# EAGLE design entrenador (EAGLE 7.3.0)
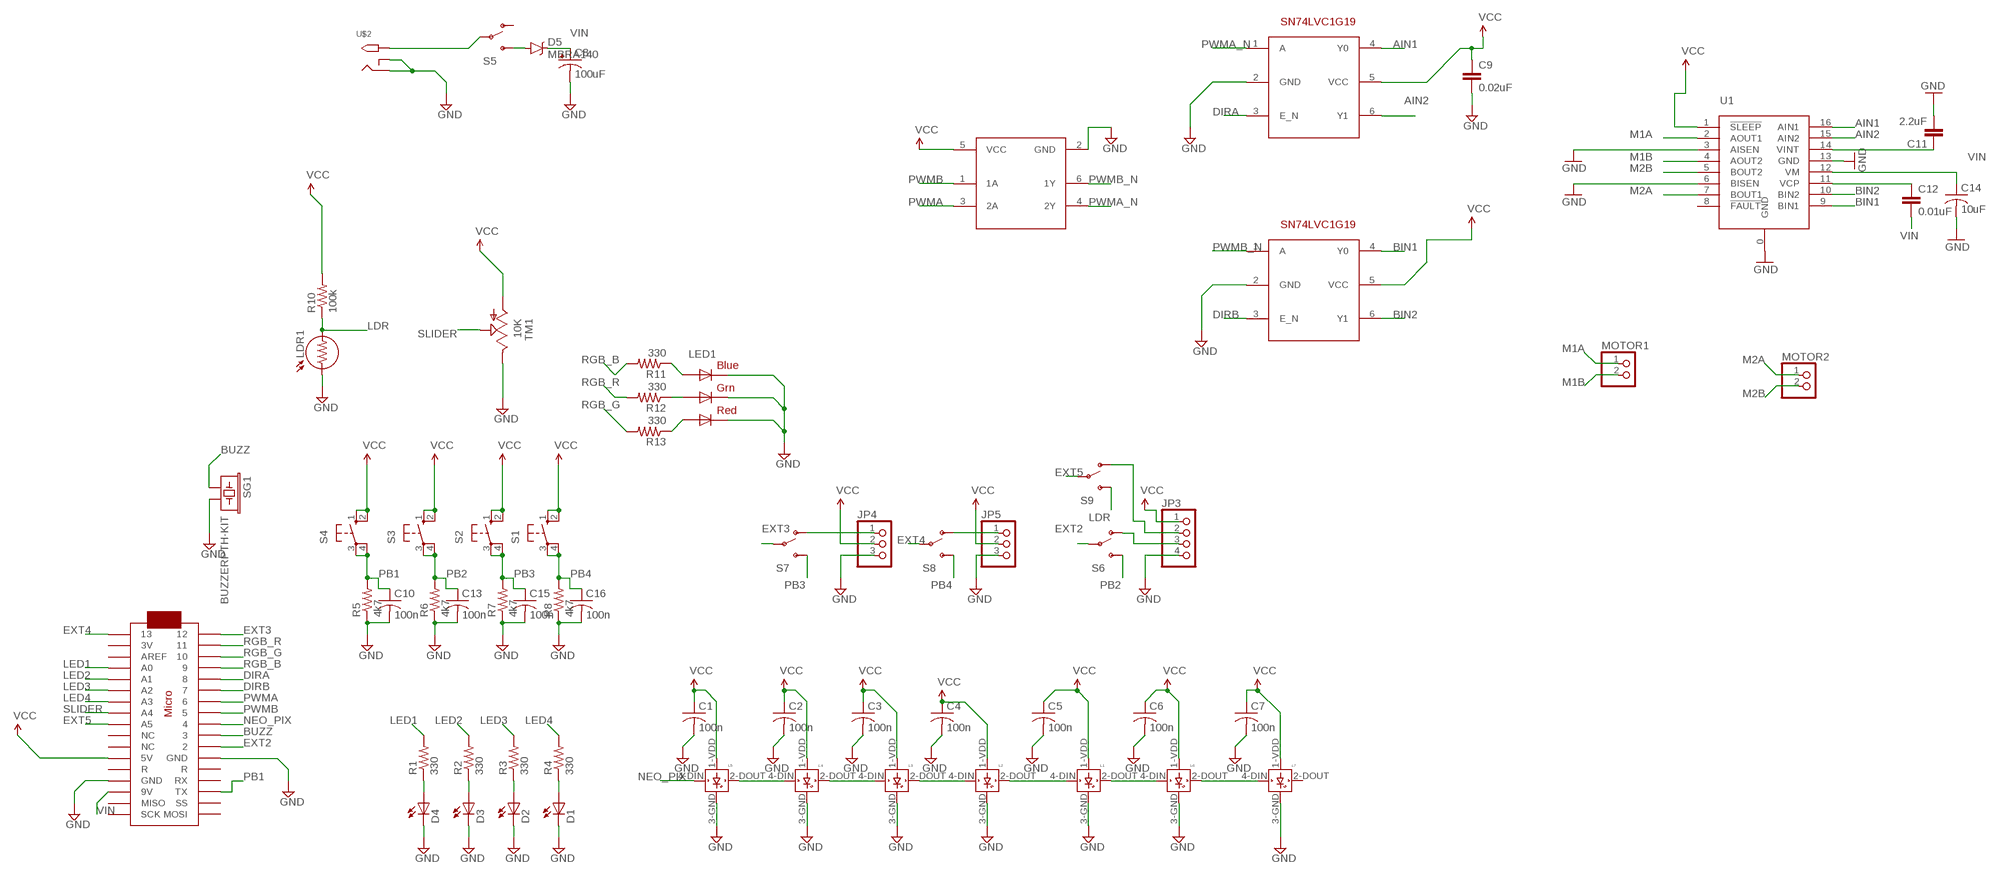
[diagram p0: schematic, sheet 1]

## Parts
C1  100n  C-USC0805  [C0805]
C2  100n  C-USC0805  [C0805]
C3  100n  C-USC0805  [C0805]
C4  100n  C-USC0805  [C0805]
C5  100n  C-USC0805  [C0805]
C6  100n  C-USC0805  [C0805]
C7  100n  C-USC0805  [C0805]
C8  100uF  CPOL-US175TMP-0808  [175TMP-0808]
C9  0.02uF  C-EUC0805  [C0805]
C10  100n  C-USC0805  [C0805]
C11  2.2uF  C-EUC0805  [C0805]
C12  0.01uF  C-EUC0805  [C0805]
C13  100n  C-USC0805  [C0805]
C14  10uF  C-USC0805K  [C0805K]
C15  100n  C-USC0805  [C0805]
C16  100n  C-USC0805  [C0805]
D1  LED5MM  [LED5MM]
D2  LED5MM  [LED5MM]
D3  LED5MM  [LED5MM]
D4  LED5MM  [LED5MM]
D5  MBRA140  [SMA-DIODE]
JP3  PINHD-1X4/90  [1X04/90]
JP4  PINHD-1X3/90  [1X03/90]
JP5  PINHD-1X3/90  [1X03/90]
L1  WS2812B  [WS2812B]
L2  WS2812B  [WS2812B]
L3  WS2812B  [WS2812B]
L4  WS2812B  [WS2812B]
L5  WS2812B  [WS2812B]
L6  WS2812B  [WS2812B]
L7  WS2812B  [WS2812B]
LDR1  LDR5MM  [LDR338-54C]
LED1  RGBLED5050  [RGBLED5050]
MOTOR1  PINHD-1X2/90  [1X02/90]
MOTOR2  PINHD-1X2/90  [1X02/90]
R1  330  R-US_M0805  [M0805]
R2  330  R-US_M0805  [M0805]
R3  330  R-US_M0805  [M0805]
R4  330  R-US_M0805  [M0805]
R5  4k7  R-US_M0805  [M0805]
R6  4k7  R-US_M0805  [M0805]
R7  4k7  R-US_M0805  [M0805]
R8  4k7  R-US_M0805  [M0805]
R10  100k  R-US_M0805  [M0805]
R11  330  R-US_M0805  [M0805]
R12  330  R-US_M0805  [M0805]
R13  330  R-US_M0805  [M0805]
S1  40-XX-ROUND  [B3F-40XX-ROUND]
S2  40-XX-ROUND  [B3F-40XX-ROUND]
S3  40-XX-ROUND  [B3F-40XX-ROUND]
S4  40-XX-ROUND  [B3F-40XX-ROUND]
S5  SWITCH-SPDT-SMD-A  [SWITCH-SPST-SMD-A]
S6  SWITCH-SPDTSS-12F44  [SS-12F44G4]
S7  SWITCH-SPDTSS-12F44  [SS-12F44G4]
S8  SWITCH-SPDTSS-12F44  [SS-12F44G4]
S9  SWITCH-SPDTSS-12F44  [SS-12F44G4]
SG1  BUZZERPTH-KIT  [BUZZER-12MM-KIT]
TM1  10K  TRIMSLIDEPOT-60  [SLIDEPOT-60]
U1  DRV8833  [PWP16]
U$1  SN74LVC1G19SN74LVC1G19-DBVR  [SOT23-6]
U$2  2.1MMJACKTHM  [PJ-102A]
U$8  ARDUINOMICRO  [ARDUINOMICRO]
U$9  SN74LVC1G19SN74LVC1G19-DBVR  [SOT23-6]
U$10  SN74LVC2G04SOT23-6  [SOT23-6]

## Nets
AIN1: U1.16(AIN1) U$1.4(Y0)
AIN2: U1.15(AIN2) U$1.6(Y1)
BIN1: U1.9(BIN1) U$9.4(Y0)
BIN2: U1.10(BIN2) U$9.6(Y1)
BUZZ: SG1.+ U$8.P$10
DIRA: U$1.3(E_N) U$8.P$5
DIRB: U$8.P$6 U$9.3(E_N)
EXT2: S6.2(P) U$8.P$11
EXT3: S7.2(P) U$8.P$1
EXT4: S8.2(P) U$8.P$34
EXT5: S9.2(P) U$8.P$26(A5)
GND: C1.2 C2.2 C3.2 C4.2 C5.2 C6.2 C7.2 C8.- C9.2 C10.2 C11.2 C13.2 C14.2 C15.2 C16.2 D1.K(C) D2.K(C) D3.K(C) D4.K(C) JP3.4 JP4.3 JP5.3 L1.3-GND(GND) L2.3-GND(GND) L3.3-GND(GND) L4.3-GND(GND) L5.3-GND(GND) L6.3-GND(GND) L7.3-GND(GND) LDR1.1 LED1.4(BLUE_C) LED1.5(RED_C) LED1.6(GREEN_C) R5.1 R6.1 R7.1 R8.1 SG1.- TM1.C(E) U1.0(GND) U1.3(AISEN) U1.6(BISEN) U1.13(GND) U$1.2(GND) U$2.RING U$2.RING_SW U$8.P$12(GND) U$8.P$21(GND) U$9.2(GND) U$10.2(GND)
LDR: LDR1.2 R10.1 S9.3(S)
LED1: R1.2 U$8.P$31(A0)
LED2: R2.2 U$8.P$30(A1)
LED3: R3.2 U$8.P$29(A2)
LED4: R4.2 U$8.P$28(A3)
M1A: MOTOR1.1 U1.2(AOUT1)
M1B: MOTOR1.2 U1.4(AOUT2)
M2A: MOTOR2.1 U1.7(BOUT1)
M2B: MOTOR2.2 U1.5(BOUT2)
N$1: D5.A S5.3(S)
N$3: JP3.3 S6.1(O)
N$4: JP3.2 S9.1(O)
N$5: D1.A R4.1
N$6: D2.A R3.1
N$7: D3.A R2.1
N$8: D4.A R1.1
N$9: JP4.1 S7.1(O)
N$10: LED1.3(BLUE_A) R11.1
N$11: LED1.1(GREEN_A) R12.1
N$12: LED1.2(RED_A) R13.1
N$14: C12.1 U1.11(VCP)
N$15: L4.4-DIN(DIN) L5.2-DOUT(DOUT)
N$16: L3.4-DIN(DIN) L4.2-DOUT(DOUT)
N$17: L2.4-DIN(DIN) L3.2-DOUT(DOUT)
N$18: L1.4-DIN(DIN) L2.2-DOUT(DOUT)
N$19: L1.2-DOUT(DOUT) L6.4-DIN(DIN)
N$20: L6.2-DOUT(DOUT) L7.4-DIN(DIN)
N$21: JP5.1 S8.1(O)
N$24: S5.2(P) U$2.TIP
N$63: C11.1 U1.14(VINT)
NEO_PIX: L5.4-DIN(DIN) U$8.P$9
PB1: C10.1 R5.2 S4.3(P) S4.4(P1) U$8.P$15(TX)
PB2: C13.1 R6.2 S3.3(P) S3.4(P1) S6.3(S)
PB3: C15.1 R7.2 S2.3(P) S2.4(P1) S7.3(S)
PB4: C16.1 R8.2 S1.3(P) S1.4(P1) S8.3(S)
PWMA: U$8.P$7 U$10.3(2A)
PWMA_N: U$1.1(A) U$10.4(2Y)
PWMB: U$8.P$8 U$10.1(1A)
PWMB_N: U$9.1(A) U$10.6(1Y)
RGB_B: R11.2 U$8.P$4
RGB_G: R13.2 U$8.P$3
RGB_R: R12.2 U$8.P$2
SLIDER: TM1.B(S) U$8.P$27(A4)
VCC: C1.1 C2.1 C3.1 C4.1 C5.1 C6.1 C7.1 C9.1 JP3.1 JP4.2 JP5.2 L1.1-VDD(VDD) L2.1-VDD(VDD) L3.1-VDD(VDD) L4.1-VDD(VDD) L5.1-VDD(VDD) L6.1-VDD(VDD) L7.1-VDD(VDD) R10.2 S1.1(S) S1.2(S1) S2.1(S) S2.2(S1) S3.1(S) S3.2(S1) S4.1(S) S4.2(S1) TM1.A U1.1(!SLEEP) U$1.5(VCC) U$8.P$23(5V) U$9.5(VCC) U$10.5(VCC)
VIN: C8.+ C12.2 C14.1 D5.C U1.12(VM) U$8.P$20(9V)
Unconnected: L7.2-DOUT(DOUT) S5.1(O) U1.8(!FAULT) U$8.P$13(R) U$8.P$14(RX) U$8.P$16(SS) U$8.P$17(MOSI) U$8.P$18(SCK) U$8.P$19(MISO) U$8.P$22(R) U$8.P$24(NC) U$8.P$25(NC) U$8.P$32(AREF) U$8.P$33(3V)

## Library data of the parts
C1-C7 C10 C13-C16 = adafruit:C-US: CAPACITOR, American symbol
C8 = adafruit:CPOL-US: POLARIZED CAPACITOR, American symbol
C9 C11 C12 = rcl:C-EU: CAPACITOR, European symbol
D1-D4 = adafruit:LED: LED OSRAM: - CHIPLED LG R971, LG N971, LY N971, LG Q971, LY Q971, LO R971, LY R971 LH N974, LH R974 LS Q976, LO Q976, LY Q976 LO Q996 - Hyper CHIPLED LW Q18S LB Q993, LB Q99A, LB R99A - SideLED LS A670, LO A670, LY A670, LG A670, LP A670 LB A673, LV A673, LT A673, LW A673 LH A674 LY A675 LS A676, LA A676, LO A676, LY A676, LW A676 LS A679, LY A679, LG A679 - Hyper Micro SIDELED® LS Y876, LA Y876, LO Y876, LY Y876 LT Y87S - SmartLED LW L88C, LW L88S LB L89C, LB L89S, LG L890 LS L89K, LO L89K, LY L89K LS L896, LA L896, LO L896, LY L896 - TOPLED LS T670, LO T670, LY T670, LG T670, LP T670 LSG T670, LSP T670, LSY T670, LOP T670, LYG T670 LG T671, LOG T671, LSG T671 LB T673, LV T673, LT T673, LW T673 LH T674 LS T676, LA T676, LO T676, LY T676, LB T676, LH T676, LSB T676, LW T676 LB T67C, LV T67C, LT T67C, LS T67K, LO T67K, LY T67K, LW E67C LS E67B, LA E67B, LO E67B, LY E67B, LB E67C, LV E67C, LT E67C LW T67C LS T679, LY T679, LG T679 LS T770, LO T770, LY T770, LG T770, LP T770 LB T773, LV T773, LT T773, LW T773 LH T774 LS E675, LA E675, LY E675, LS T675 LS T776, LA T776, LO T776, LY T776, LB T776 LHGB T686 LT T68C, LB T68C - Hyper Mini TOPLED® LB M676 - Mini TOPLED Santana® LG M470 LS M47K, LO M47K, LY M47K Source: http://www.osram.convergy.de/
D5 = SparkFun-DiscreteSemi:MBRA140: 40V, 1A Schottky rectifier SMA/DO-214AC package DIO-08053; PROD_ID: DIO-08053
JP3 = pinhead:PINHD-1X4: PIN HEADER
JP4 JP5 = pinhead:PINHD-1X3: PIN HEADER
L1-L7 = adafruit:WS2812B
LDR1 = gm-resistors:LDR
LED1 = adafruit:RGBLED: For 5050 RGB LEDs, the order of the LEDs may vary from one manufacturer to another!
MOTOR1 MOTOR2 = pinhead:PINHD-1X2: PIN HEADER
R1-R8 R10-R13 = rcl:R-US_: RESISTOR, American symbol
S1-S4 = adafruit:40-XX: OMRON SWITCH
S5 = SparkFun-Electromechanical:SWITCH-SPDT: SPDT Switch Simple slide switch, Spark Fun Electronics SKU : COM-00102 DPDT SMT slide switch, AYZ0202, SWCH-08179; PROD_ID: SWCH-10651
S6-S9 = SparkFun-Electromechanical:SWITCH-SPDT: SPDT Switch Simple slide switch, Spark Fun Electronics SKU : COM-00102 DPDT SMT slide switch, AYZ0202, SWCH-08179
SG1 = SparkFun-Electromechanical:BUZZER: Buzzer 12mm Spark Fun Electronics SKU : Comp-Buzzer; PROD_ID: COMP-08253
TM1 = adafruit:TRIM
U1 = DRV8833:DRV8833
U$1 U$9 = frizzy:SN74LVC1G19
U$2 = adafruit:2.1MMJACK: 2.1mm x 5.5mm THM DC jack with internal switch. Digikey part #PJ-102A, 4UCON part #05537 2.1mm x 5.5mm SMT DC jack with internal switch. Digikey part #PJ-002A-SMT, 4UCON part #03267 By microbuilder.eu & adafruit.com
U$8 = adafruit:ARDUINOMICRO
U$10 = frizzy:SN74LVC2G04

## Board
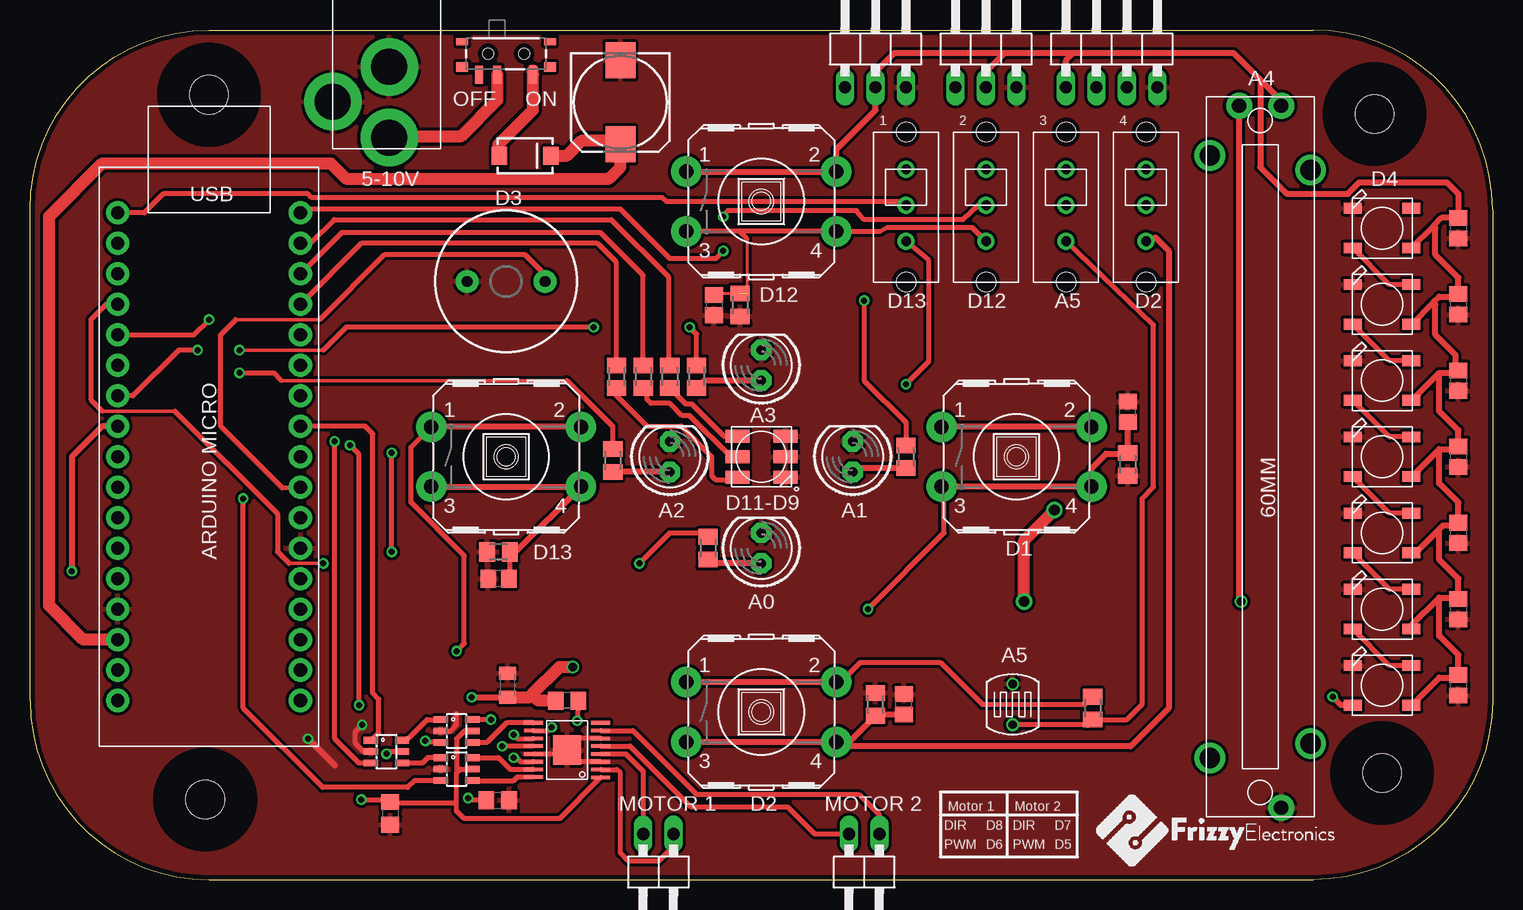
[diagram p1: board, top side]
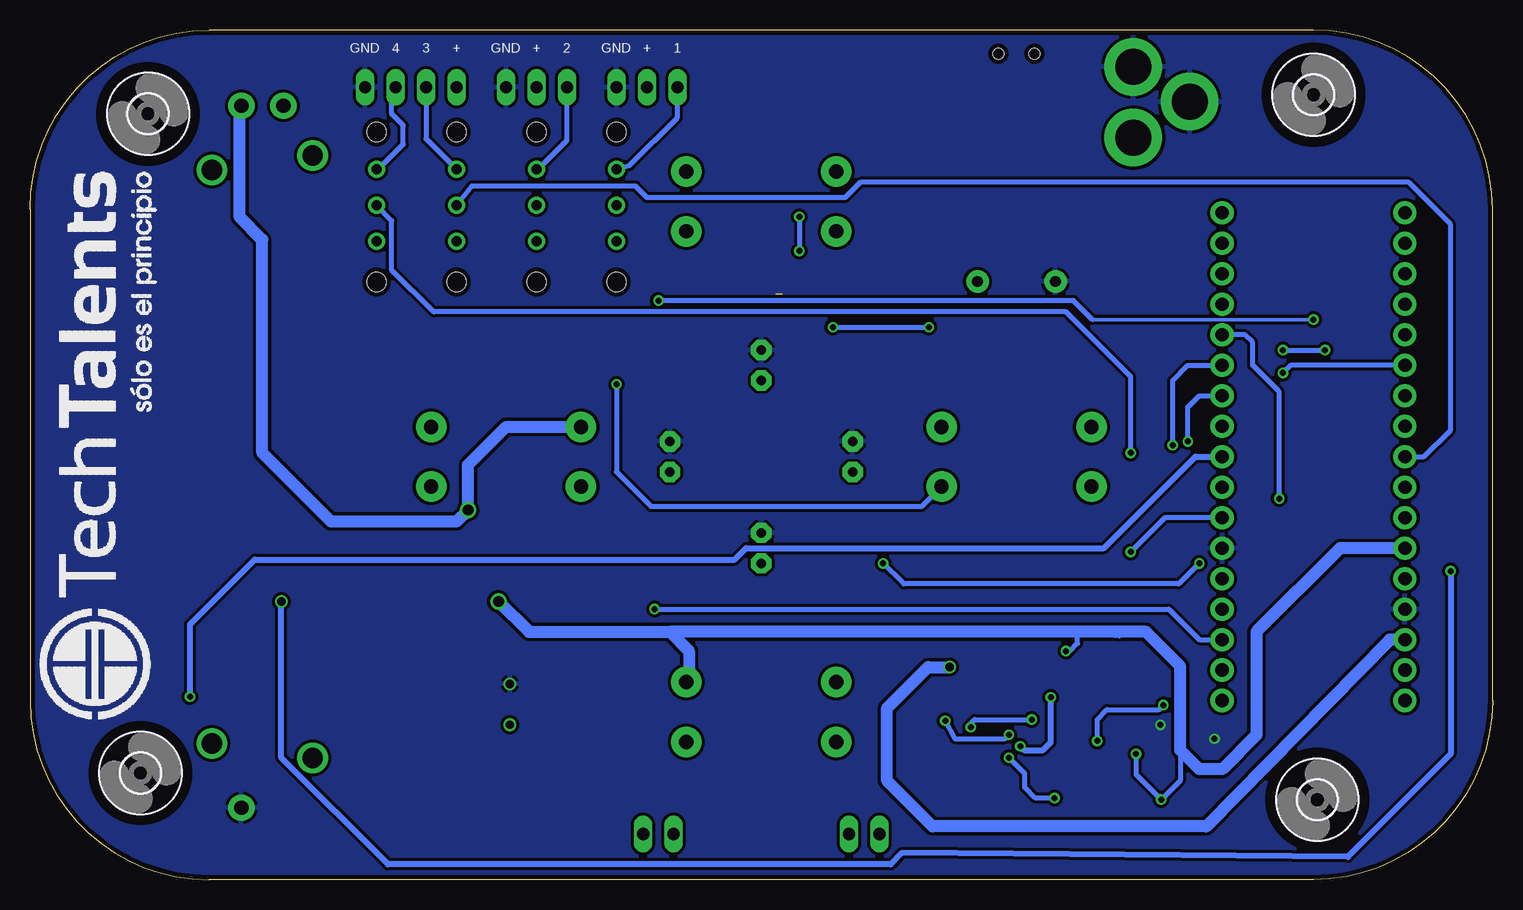
[diagram p2: board, bottom side, seen from below]

Size 121.92 x 70.8 mm. Coordinates in mm from the lower left corner, seen from the top.
Outline: 0,14.92 0,55.88 arc-90 14.92,70.8 107,70.8 arc-90 121.92,55.88 121.92,14.92 arc-90 107,0 14.92,0 arc-90 0,14.92
Copper layers (1*16): Top 0.0356mm / dielectric 1.5011mm / Bottom 0.0356mm
Design rules "oshpark-2layer": minimum track width 6mil, minimum drill 13mil, track to track 6mil, track to pad 6mil, pad to pad 6mil, via to via 6mil, smd to smd 6mil, copper to edge 15mil, drill to drill 6mil, minimum pad ring 7mil, minimum via ring 7mil, stop-mask expansion 2.5mil, vias tented up to drill 0mil, thermal gap 10mil

### Footprints (pad centres in the part's own frame; a part is rotated, then mirrored left to right if it is on the bottom)
C0805 = smd 1.3 x 1.5: 1 -0.85,0; 2 0.85,0
175TMP-0808 = smd 3 x 2.5: + 3.5,0; - -3.5,0
C0805' = smd 1.3 x 1.5: 1 -0.95,0; 2 0.95,0
C0805K = smd 1.1 x 1.4: 1 -1,0; 2 1,0
LED5MM = drill 0.813 pad 1.676 octagon: A -1.27,0; K 1.27,0
SMA-DIODE = smd 1.27 x 1.47: A -2.15,0; C 2.15,0
1X04/90 = drill 1.016 long: 1 -3.81,-3.81; 2 -1.27,-3.81; 3 1.27,-3.81; 4 3.81,-3.81
1X03/90 = drill 1.016 long: 1 -2.54,-3.81; 2 0,-3.81; 3 2.54,-3.81
WS2812B = smd 1.5 x 0.9: 1-VDD 2.45,-1.65; 2-DOUT 2.45,1.65; 3-GND -2.45,1.65; 4-DIN -2.45,-1.65
LDR338-54C = drill 0.7: 1 0,1.702; 2 0,-1.702
RGBLED5050 = smd 2 x 1.1: 1 -2,1.7; 2 -2,0; 3 -2,-1.7; 4 2,-1.7; 5 2,0; 6 2,1.7
1X02/90 = drill 1.016 long: 1 -1.27,-3.81; 2 1.27,-3.81
M0805 = smd 1.3 x 1.6: 1 -0.95,0; 2 0.95,0
B3F-40XX-ROUND = drill 1.194 pad 2.54: 1 -6.248,2.489; 2 6.248,2.489; 3 -6.248,-2.489; 4 6.248,-2.489
SWITCH-SPST-SMD-A = smd 0.7 x 1.5: 1 -2.25,-1.75; 2 -0.75,-1.75; 3 2.25,-1.75 | smd 1 x 0.6: GND1 -3.65,1; GND3 3.65,1 | smd 1 x 0.8: GND2 -3.65,-1.1; GND4 3.65,-1.1 | hole 0.9: -1.5,0; 1.5,0
SS-12F44G4 = drill 0.8 pad 1.422: 1 -3,0; 2 0,0; 3 3,0 | hole 1.6: -6.1,0; 6.4,0
BUZZER-12MM-KIT = drill 0.9 pad 1.88: + 3.25,0; - -3.25,0
SLIDEPOT-60 = drill 1.2 pad 2.184: A -29.249,1.751; B -29.249,-1.749; C 29.251,1.751 | drill 1.7 pad 2.54: P$1 -23.899,4.201; P$2 23.901,4.201; P$3 -25.099,-4.199; P$4 25.101,-4.199
PWP16 = smd 2.46 x 2.31: 0 0,0 | smd 0.3 x 1.6: 1 -2.275,-2.8; 2 -1.625,-2.8; 3 -0.975,-2.8; 4 -0.325,-2.8; 5 0.325,-2.8; 6 0.975,-2.8; 7 1.625,-2.8; 8 2.275,-2.8; 9 2.275,2.8; 10 1.625,2.8; 11 0.975,2.8; 12 0.325,2.8; 13 -0.325,2.8; 14 -0.975,2.8; 15 -1.625,2.8; 16 -2.245,2.8
SOT23-6 = smd 0.55 x 1.2: 1 -0.95,-1.3; 2 0,-1.3; 3 0.95,-1.3; 4 0.95,1.3; 5 0,1.3; 6 -0.95,1.3
PJ-102A = drill 3 pad 4.8: RING 0.1,-3.39; RING_SW -4.6,-6.29; TIP 0.1,-9.29
3,2 = hole 3.2: 0,0
ARDUINOMICRO = drill 1.1 pad 1.93: P$1 -20.32,7.62; P$2 -17.78,7.62; P$3 -15.24,7.62; P$4 -12.7,7.62; P$5 -10.16,7.62; P$6 -7.62,7.62; P$7 -5.08,7.62; P$8 -2.54,7.62; P$9 0,7.62; P$10 2.54,7.62; P$11 5.08,7.62; P$12 12.7,-7.62; P$13 10.16,-7.62; P$14 12.7,7.62; P$15 15.24,7.62; P$16 17.78,7.62; P$17 20.32,7.62; P$18 20.32,-7.62; P$19 17.78,-7.62; P$20 15.24,-7.62; P$21 7.62,7.62; P$22 10.16,7.62; P$23 7.62,-7.62; P$24 5.08,-7.62; P$25 2.54,-7.62; P$26 0,-7.62; P$27 -2.54,-7.62; P$28 -5.08,-7.62; P$29 -7.62,-7.62; P$30 -10.16,-7.62; P$31 -12.7,-7.62; P$32 -15.24,-7.62; P$33 -17.78,-7.62; P$34 -20.32,-7.62

### Placement (x,y rotation side)
C1  119.06,54.29 270 top
C2  119.06,47.94 270 top
C3  119.06,41.59 270 top
C4  119.06,35.24 270 top
C5  119.06,28.89 270 top
C6  119.06,22.54 270 top
C7  119.06,16.19 270 top
C8  49.21,64.77 270 top
C9  0.02uF  [C0805']  30.04,5.52 270 top
C10  91.5,38.99 90 top
C11  2.2uF  [C0805']  38.99,6.6 0 top
C12  0.01uF  [C0805']  44.77,14.92 180 top
C13  72.83,14.6 90 top
C14  39.81,16.19 90 top
C15  57.02,47.88 270 top
C16  39.05,25.08 180 top
D1  60.96,42.86 90 top
D2  53.34,35.24 90 top
D3  68.58,35.24 90 top
D4  60.96,27.62 90 top
D5  41.27,60.32 0 top
JP3  90.17,69.85 0 top
JP4  79.69,69.85 0 top
JP5  70.48,69.85 0 top
L1  112.71,41.59 0 top
L2  112.71,35.24 0 top
L3  112.71,28.89 0 top
L4  112.71,22.54 0 top
L5  112.71,16.19 0 top
L6  112.71,47.94 0 top
L7  112.71,54.29 0 top
LDR1  81.92,14.6 0 top
LED1  60.96,35.24 0 top
MOTOR1  52.39,0 180 top
MOTOR2  69.53,0 180 top
R1  56.52,27.62 90 top
R2  73.03,35.24 90 top
R3  48.58,34.92 90 top
R4  55.56,41.91 90 top
R5  91.5,34.61 90 top
R6  70.48,14.6 270 top
R7  59.18,47.88 90 top
R8  39.05,27.3 0 top
R10  88.58,14.29 90 top
R11  48.9,41.91 90 top
R12  53.34,41.91 90 top
R13  51.12,41.91 90 top
S1  39.69,35.24 0 top
S2  60.96,56.52 0 top
S3  60.96,13.97 0 top
S4  82.23,35.24 0 top
S5  39.69,68.83 0 top
S6  93.03,56.2 270 top
S7  79.69,56.2 270 top
S8  73.03,56.2 270 top
S9  86.36,56.2 270 top
SG1  39.69,49.85 0 top
TM1  102.55,35.24 270 top
U1  44.77,10.79 90 top
U$1  35.56,9.21 270 top
U$2  29.84,71.12 0 top
U$3  [3,2]  112.08,63.82 0 bottom
U$4  [3,2]  14.92,65.41 0 bottom
U$5  [3,2]  112.71,8.89 0 bottom
U$6  [3,2]  14.61,6.67 0 bottom
U$8  14.92,35.24 270 top
U$9  35.56,12.38 270 top
U$10  29.72,10.67 270 top

### Tracks (layer width: path | path; a pad name or v marks a point on that pad's centre or on a via)
AIN1
  Top 0.406: U$1.4 40.33,8.26 40.64,8.57 41.95,8.57 U1.16
AIN2
  Top 0.406: U$1.6 39.05,10.16 40.01,9.21 41.93,9.21 U1.15
BIN1
  Top 0.406: U$9.4 38.1,11.43 39.74,13.07 U1.9
BIN2  (via drill 0.5)
  Top 0.406: U1.10 43.22,12.42 v43.5,12.7 | v38.42,13.33 U$9.6
  Bottom 0.406: v43.5,12.7 43.5,13.02 43.18,13.33 v38.42,13.33
BUZZ
  Top 0.305: 24.13,46.67 17.14,46.67
  Top 0.406: SG1.+ 42.94,50.41 41.27,52.07 29.53,52.07 24.13,46.67 | 17.14,46.67 15.88,45.4 15.88,37.78 21.02,32.64 U$8.P$10
DIRA  (via drill 0.5)
  Top 0.406: v17.78,31.75 17.78,14.29 24.38,7.68 31.5,7.68 32.07,8.26 U$1.3
  Bottom 0.406: v17.78,31.75 17.78,40.64 20,42.86 20,44.77 20.64,45.4 U$8.P$5
DIRB  (via drill 0.5)
  Top 0.406: U$9.3 33.08,11.43 v32.96,11.56 | v27.43,14.54 27.43,35.43 v26.67,36.2
  Bottom 0.406: v26.67,36.2 26.67,41.59 25.4,42.86 U$8.P$6 | v32.96,11.56 32.96,13.33 32.13,14.16 27.81,14.16 v27.43,14.54
EXT2  (via drill 0.5)
  Top 0.406: v30.16,27.3 v30.16,35.56
  Bottom 0.406: U$8.P$11 27.3,30.16 v30.16,27.3 | v30.16,35.56 30.16,41.91 35.56,47.31 88.27,47.31 91.76,50.8 91.76,54.93 S6.2
EXT3  (via drill 0.5)
  Top 0.406: S7.2 79.06,56.2 77.79,54.99 69.53,54.99 68.9,55.75 58.17,55.75 v57.78,55.24 | v57.78,52.39 57.15,51.75 53.34,51.75 49.21,55.88 22.86,55.88 U$8.P$1
  Bottom 0.406: v57.78,55.24 v57.78,52.39
EXT4
  Top 0.406: U$8.P$34 9.53,55.56 11.11,57.15 23.18,57.15 23.5,56.83 52.7,56.83 53.02,56.52 72.71,56.52 S8.2
EXT5
  Bottom 0.406: U$8.P$26 5.71,35.24 3.49,37.46 3.49,54.61 6.99,58.1 52.7,58.1 53.98,56.83 70.48,56.83 71.44,57.79 85.09,57.79 S9.2
GND  (via drill 0.5)
  Top 0.406: U1.13 44.44,10.47 | U1.6 45.74,11.77 | U1.3 45.74,9.82 | U$10.2 27.81,10.67 27.11,11.37 27.11,12.32 v27.69,12.89 | U$9.2 35.05,12.38 35.56,12.89 35.56,13.84
  Top 0.508: 45.74,11.77 U1.0 | 45.74,9.82 U1.0 | 44.44,10.47 U1.0 | 25.4,9.53 v23.18,11.75
  pour Top (isolate 0.254): 0,70.8 -0.32,-0.6 121.85,-0.65 121.92,70.8
  pour Bottom (isolate 0.254): -3.17,70.8 -2.66,-0.78 124.31,-1.58 125.09,70.8
LDR
  Top 0.406: R10.1 91.44,13.34 92.71,14.6 92.71,31.75 93.66,32.7 93.66,46.21 S9.3 | 88.15,12.9 LDR1.2
  Top 0.508: 88.15,12.9 R10.1
LED1  (via drill 0.5)
  Top 0.305: 6.03,39.05 12.06,39.05 | 21.59,26.35 v24.45,26.35
  Top 0.406: U$8.P$31 6.35,47.94 5.08,46.67 5.08,40 6.03,39.05 | 12.06,39.05 20.64,30.48 20.64,27.3 21.59,26.35 | R1.2 56.2,28.89 53.34,28.89 v50.8,26.35
  Bottom 0.406: v24.45,26.35 26.16,24.64 49.09,24.64 v50.8,26.35
LED2  (via drill 0.5)
  Top 0.406: U$8.P$30 13.65,45.4 v14.92,46.67 | v69.53,48.26 69.53,41.59 73.03,38.1 R2.2
  Bottom 0.305: v14.92,46.67 33.34,46.67
  Bottom 0.406: 33.34,46.67 34.92,48.26 v69.53,48.26
LED3  (via drill 0.5)
  Top 0.305: 20.95,41.59 44.77,41.59
  Top 0.406: v17.46,42.23 20.32,42.23 20.95,41.59 | 44.77,41.59 48.58,37.78 R3.2
  Bottom 0.406: U$8.P$29 16.83,42.86 v17.46,42.23
LED4  (via drill 0.5)
  Top 0.305: 24.45,44.13 v17.46,44.13
  Top 0.406: v46.99,46.04 26.35,46.04 24.45,44.13 | v13.97,44.13 12.38,44.13 8.57,40.32 U$8.P$28 | R4.2 55.56,45.47 v54.99,46.04
  Bottom 0.406: v54.99,46.04 v46.99,46.04 | v17.46,44.13 v13.97,44.13
M1A
  Top 0.406: U1.2 48.93,9.17 49.21,8.89 49.21,2.22 49.91,1.52 52.39,1.52 53.66,2.79
  Top 0.508: MOTOR1.1 53.66,2.79
M1B
  Top 0.406: U1.4 49.66,10.47 51.12,9.02 MOTOR1.2
M2A
  Top 0.406: U1.7 50.26,12.42 55.56,7.11 69.09,7.11 70.8,5.4 MOTOR2.1
M2B
  Top 0.406: MOTOR2.2 65.41,3.81 63.17,6.04 63.17,6.03 55.12,6.03 50.03,11.12 U1.5
N$1
  Top 1.016: S5.3 41.91,67.44 41.91,64.14 39.05,61.28 39.05,60.4 D5.A
N$3
  Bottom 0.406: JP3.3 91.76,65.72 91.76,63.82 90.81,62.87 90.81,61.28 92.89,59.2 S6.1
N$4
  Bottom 0.406: JP3.2 88.9,61.74 S9.1
N$5
  Top 0.508: D1.A 56.2,41.59 R4.1
N$6
  Top 0.508: D2.A 48.9,33.97 R3.1
N$7
  Top 0.508: R2.1 68.9,34.29 D3.A
N$8
  Top 0.508: D4.A 56.84,26.35 R1.1
N$9
  Bottom 0.406: S7.1 79.23,59.51 77.15,61.59 JP4.1
N$10
  Top 0.406: R11.1 48.9,40.32 51.44,37.78 54.29,37.78 56.83,35.24 56.83,33.66 57.15,33.34 58.76,33.34
  Top 0.508: 58.76,33.34 LED1.3
N$11
  Top 0.406: R12.1 54.68,39.62 55.18,39.62 57.86,36.94 LED1.1
N$12
  Top 0.406: 51.44,40.64 51.44,40 51.75,39.69 53.34,39.69 54.36,38.67 54.99,38.67 58.42,35.24
  Top 0.508: LED1.2 58.42,35.24 | 51.44,40.64 R13.1
N$14  (via drill 0.5)
  Top 0.406: C12.1 v45.62,13.23 | v40.32,12.06 40.64,11.75 41.95,11.75 U1.11
  Bottom 0.406: v45.62,13.23 44.83,11.75 40.64,11.75 v40.32,12.06
N$15
  Top 0.406: L5.2-DOUT 113.31,17.84 L4.4-DIN
N$16
  Top 0.406: L4.2-DOUT 113.31,24.19 L3.4-DIN
N$17
  Top 0.406: L3.2-DOUT 113.31,30.54 L2.4-DIN
N$18
  Top 0.406: L2.2-DOUT 113.31,36.89 L1.4-DIN
N$19
  Top 0.406: L1.2-DOUT 113.31,43.24 L6.4-DIN
N$20
  Top 0.406: L6.2-DOUT 113.31,49.59 L7.4-DIN
N$21
  Bottom 0.406: S8.1 71.93,59.51 67.94,63.5 JP5.1
N$24
  Top 1.016: S5.2 38.94,64.97 35.88,61.91 30.03,61.91 U$2.TIP
N$63  (via drill 0.5)
  Top 0.406: C11.1 36.7,6.6 v36.51,6.79 | v40.32,10.16 40.58,10.16 40.89,9.84 41.95,9.84 U1.14
  Bottom 0.406: v36.51,6.79 38.1,6.79 38.99,7.68 38.99,8.83 v40.32,10.16
NEO_PIX  (via drill 0.5)
  Top 0.508: L5.4-DIN 109.28,14.54 v108.58,15.24
  Bottom 0.508: v108.58,15.24 108.58,21.27 103.19,26.67 63.18,26.67 62.23,27.62 32.38,27.62 24.77,35.24 U$8.P$9
PB1  (via drill 0.5)
  Top 0.406: v69.85,22.54 76.2,28.89 76.2,32.54 S4.3
  Top 0.508: S4.3 S4.4 88.48,34.25 89.72,35.5 91.44,35.5 R5.2 C10.1
  Bottom 0.406: v69.85,22.54 26.99,22.54 24.45,20 U$8.P$15
PB2
  Top 0.508: S3.4 68.31,11.48 R6.2 70.58,13.76 C13.1 | S3.3 S3.4 | S6.3 93.81,53.52 94.93,52.39 94.93,14.29 91.76,11.11 67.58,11.11 S3.4
PB3  (1 unrouted)
  Top 0.254: 59.75,53.39 59.75,48.83 57.13,48.83 arc90 C15.1
  Top 0.406: 59.12,54.03 S2.4 70.85,54.03 71.44,54.36 78.53,54.36 S7.3 | 59.12,54.03 S2.3 | 59.75,53.39 59.12,54.03
PB4  (via drill 0.5)
  Top 0.406: v73.03,41.27 74.93,43.18 74.93,51.61 S8.3 | C16.1 40,25.08 R8.2
  Top 0.508: R8.2 40.49,27.3 S1.4 S1.3
  Bottom 0.406: v73.03,41.27 73.03,33.97 70.17,31.12 47.57,31.12 S1.4
PWMA  (via drill 0.5)
  Top 0.406: v25.4,36.51 25.4,11.75 27.43,9.72 U$10.3
  Bottom 0.406: v25.4,36.51 25.4,39.37 24.45,40.32 U$8.P$7
PWMA_N
  Top 0.406: U$1.1 33.15,10.16 32.7,9.72 31.59,9.72 U$10.4
PWMB
  Top 0.406: U$8.P$8 27.94,37.78 28.57,37.15 28.57,15.56 29.08,15.05 29.08,12.26 28.45,11.62 U$10.1
PWMB_N
  Top 0.406: U$10.6 31.59,11.84 33.08,13.33 U$9.1
RGB_B
  Top 0.406: R11.2 48.9,51.43 47.31,53.02 27.62,53.02 U$8.P$4
RGB_G
  Top 0.406: R13.2 51.12,50.36 47.56,53.91 25.97,53.91 U$8.P$3
RGB_R
  Top 0.406: U$8.P$2 23.37,53.02 25.34,54.99 48.45,54.99 53.21,50.23 53.21,42.99 R12.2
SLIDER  (via drill 0.5, 0.7)
  Top 0.508: U$8.P$27 6.03,37.78 3.49,35.24 v3.49,25.72 | v100.97,23.18 100.8,23.34 TM1.B
  Bottom 0.508: v3.49,25.72 3.49,10.48 12.06,1.91 49.21,2.22 50.16,1.27 92.08,1.27 100.97,10.15 v100.97,23.18
VCC  (via drill 0.5, 0.9)
  Top 0.406: v35.56,19.05 36.2,19.69 36.2,26.99 31.75,31.43 31.75,36.04 S1.1 | S3.2 67.58,16.46 69.22,18.1 75.88,18.1 79.38,14.6 87.95,14.6 R10.2 | 35.56,6.35 35.56,5.71 36.2,5.08 44.13,5.08 U1.1 | 35.56,6.35 35.56,8.89 | 35.56,8.89 35.88,9.21 U$1.5 | U$9.5 36.2,12.38 35.56,11.75 35.56,8.89 | v27.62,6.67 29.74,6.67 C9.1 30.06,6.35 35.56,6.35 | U$10.5 29.91,10.67 v29.72,10.48
  Top 0.508: S3.2 S3.1 | S4.2 S4.1 | S1.2 S1.1 | S2.1 S2.2 67.21,60.86 70.48,64.14 JP5.2 70.48,67.31 72.07,68.9 81.28,68.9 | 116.98,54.46 117.66,55.14 C1.1 119.06,57.15 118.11,58.1 110.81,58.1 109.86,57.15 104.78,57.15 102.55,59.37 102.55,66.68 | 116.98,54.46 L7.1-VDD | 116.98,54.46 117.16,54.29 117.16,52.07 119.06,50.16 C2.1 118.85,48.58 117.47,48.58 117,48.1 | L6.1-VDD 115.19,46.29 117,48.1 | 117,48.1 117.16,47.94 117.16,45.4 118.85,43.71 118.85,42.44 C3.1 118.85,42.23 117.47,42.23 | L1.1-VDD 115.19,39.94 117.47,42.23 | 117.47,42.23 117.47,39.05 119.06,37.46 C4.1 118.85,35.88 117.47,35.88 117.32,35.72 | L2.1-VDD 115.19,33.59 117.32,35.72 | 117.32,35.72 117.47,35.56 117.47,33.02 119.06,31.43 C5.1 118.85,29.53 117.79,29.53 117.32,29.05 | L3.1-VDD 115.51,27.24 117.32,29.05 | 117.32,29.05 117.47,28.89 117.47,26.67 119.06,25.08 C6.1 118.96,23.49 117.47,23.49 | L4.1-VDD 115.16,21.18 117.47,23.49 | 117.47,23.49 117.47,20.32 119.06,18.73 C7.1 118.85,16.83 117.47,16.83 115.19,14.54 L5.1-VDD | 81.28,68.9 87,68.9 | 87,68.9 100.33,68.9 102.55,66.68 | TM1.A 104.3,64.92 102.55,66.68 | JP4.2 79.69,67.31 81.28,68.9 | JP3.1 86.36,68.26 87,68.9
  Top 1.016: v82.87,23.18 82.87,28.26 v85.41,30.8
  Bottom 0.406: 31.11,20.32 31.43,20.64 | v35.56,19.05 35.24,19.05 34.61,19.69 34.61,20.64 | 26.04,10.79 26.04,8.26 v27.62,6.67 29.72,8.76 v29.72,10.48
  Bottom 1.016: U$8.P$23 12.7,27.62 19.68,20.64 19.68,12.06 22.54,9.21 24.45,9.21 26.04,10.79 26.04,17.78 28.89,20.64 31.43,20.64 34.61,20.64 68.58,20.64 | S3.2 66.99,16.67 66.99,19.05 68.58,20.64 | v82.87,23.18 80.33,20.64 68.58,20.64 | S4.1 82.23,37.73 85.41,34.56 v85.41,30.8 86.36,29.84 96.84,29.84 102.55,35.56 102.55,53.34 104.46,55.24 104.46,64.34 TM1.A
VIN  (via drill 0.5, 0.7)
  Top 0.406: U1.12 v39.38,11.12
  Top 0.508: v39.38,11.12 v39.37,11.11 | v36.83,15.19 C14.1
  Top 1.016: U$8.P$20 4.45,20 1.59,22.86 1.59,55.24 6.03,59.69 25.08,59.69 26.35,58.42 48.26,58.42 49.21,59.37 C8.+ | 49.2,61.91 C8.+ | C8.+ 48.89,61.59 46.04,61.59 44.77,60.32 D5.C | v45.26,17.72 44.13,17.72 41.85,15.43 | 41.85,15.43 41.59,15.18 39.83,15.18 C14.1 | C12.2 42.35,14.92 41.85,15.43
  Bottom 0.508: v39.37,11.11 39.05,10.79 37.47,10.79 36.83,11.43 v36.83,15.19
  Bottom 1.016: U$8.P$20 8.57,20 23.88,4.45 46.67,4.45 50.48,8.26 50.48,14.29 47.05,17.72 v45.26,17.72

### Text on the board
tNames: A4 | OFF | ON | 1 | 2 | 3 | 4 | 5-10V | D4 | USB | D3 | D12 | D13 | D12 | A5 | D2 | A3 | A2 | D11-D9 | A1 | ARDUINO MICRO | D13 | D1 | A0 | A5 | MOTOR 1 | D2 | MOTOR 2 | Motor 1 | Motor 2 | DIR | D8 | DIR | D7 | PWM | D6 | PWM | D5
bNames: 1 | + | GND | 2 | + | GND | + | 3 | 4 | GND
tStop: v1.1
Document: Entrenador Basico para Arduino Micro.